# EasyEDA Pro project 交直流电流检测.eprj

# Schematic Schematic1
Board Name: Board1; Create Date: 2025-11-02; Page Name: P1; Project Name: 交直流电流检测; Schematic Name: Schematic1; Update Date: 2026-01-12; Company: 嘉立创EDA; Page Size: A4; Version: V1.0
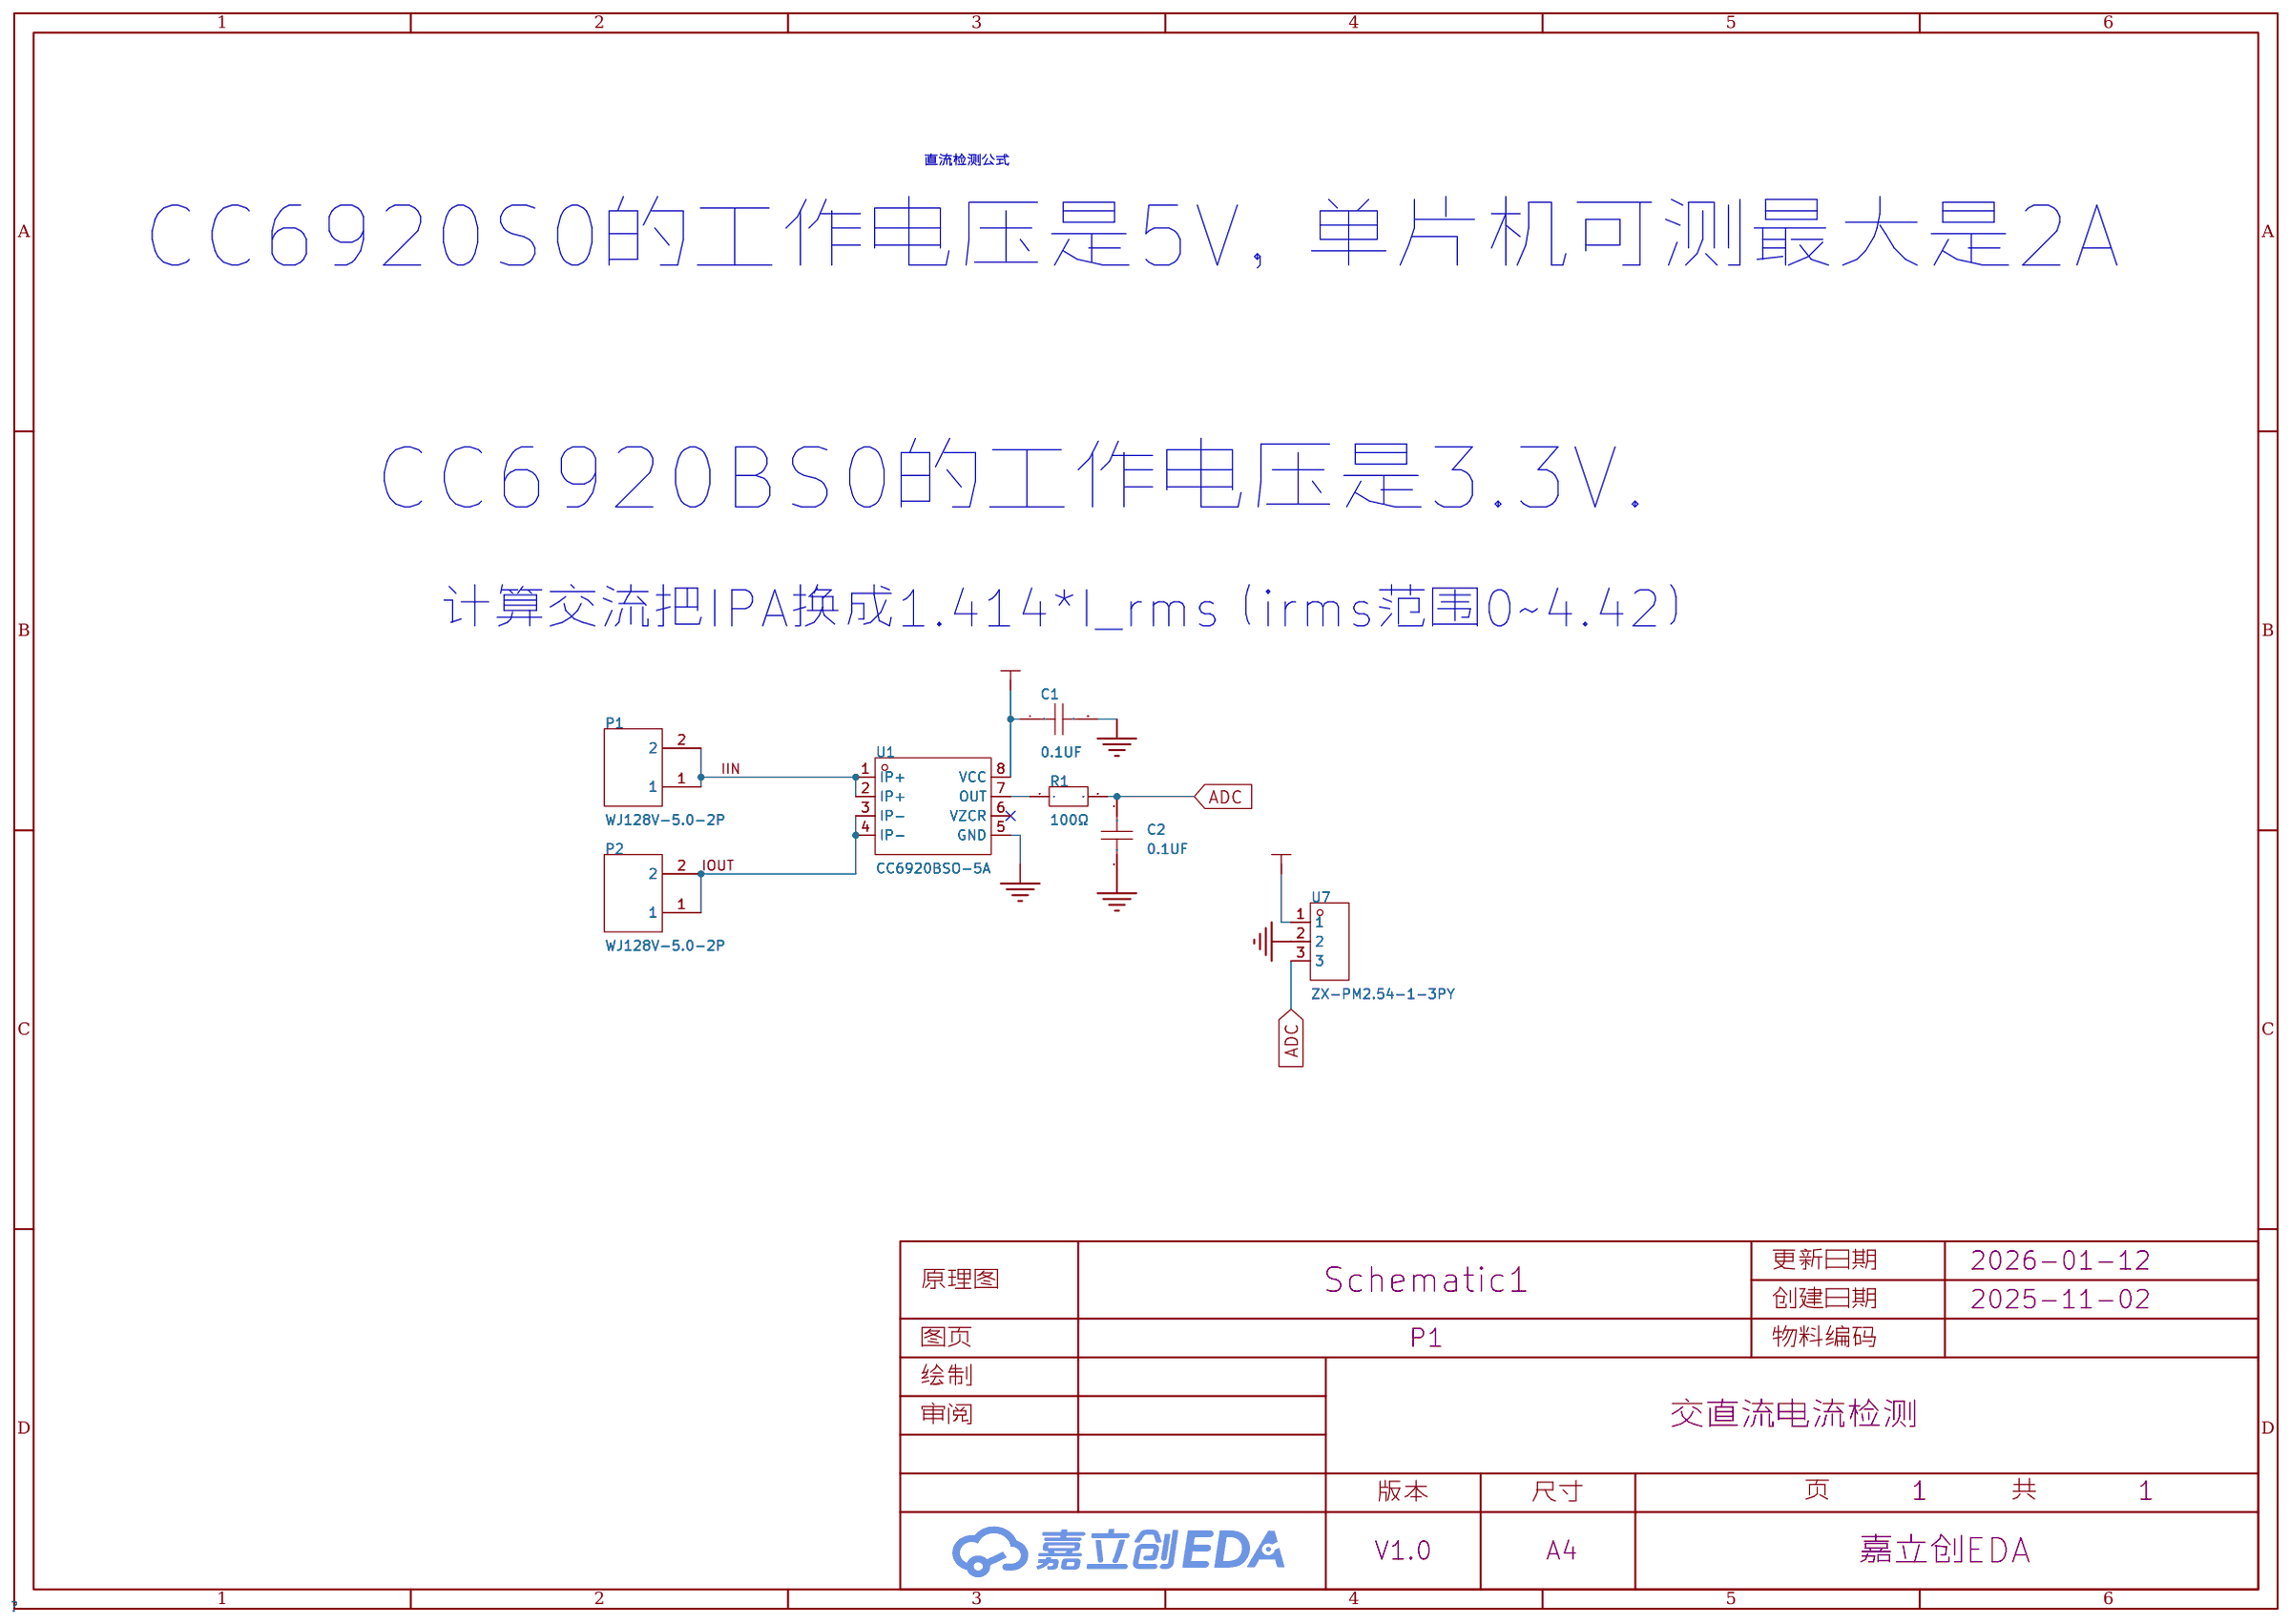
[diagram p0: schematic sheet]

## Parts
C1  0.1UF  [C0805]
C2  0.1UF  [C0805]
P1  WJ128V-5.0-2P  [CONN-TH_2P-P5.00_WJ128V-5.0-2P]
P2  WJ128V-5.0-2P  [CONN-TH_2P-P5.00_WJ128V-5.0-2P]
R1  100Ω  [C0805]
U1  CC6920BSO-5A  [SOP-8_L4.9-W3.9-P1.27-LS6.0-BL]
U7  ZX-PM2.54-1-3PY  [HDR-TH_3P-P2.54-V-F]

## Library data of the parts
C1 C2 = C2012C0G2A103JT000N: LCSC Part Name: 10nF ±5% 100V; Supplier Part: C49296936; Manufacturer: TDK; Supplier Footprint: 0805; JLCPCB Part Class: 扩展库; Datasheet: https://item.szlcsc.com/datasheet/C2012C0G2A103JT000N/51750894.html; Supplier: LCSC; Tolerance: ±5%; Voltage Rating: 100V
P1 P2 = WJ128V-5.0-2P: LCSC Part Name: 5mm 1x2P 排数:1 每排P数:2 直插; Supplier Part: C8269; Manufacturer: KANGNEX(康奈克斯电气); Supplier Footprint: 插件,P=5mm; JLCPCB Part Class: 扩展库; Datasheet: https://atta.szlcsc.com/upload/public/pdf/source/20191225/C8269_1FF44D6D2E83DB14A7CA266A410FD9AD.pdf; Supplier: LCSC; Structure: 1x2P; Pitch: 5mm; Color: 绿色; Mounting Style: 直插; Current Rating (Max): 20A; Voltage Rating (Max): 250V; Number of Pins: 2P; Number of Rows: 1; Wire Gauge - AWG: 12~22; Wire Gauge - mm2: 2.5; Number of PINs Per Row: 2; Operating Temperature Range: -40℃~+105℃
R1 = ERJ-U06F2R20V: LCSC Part Name: 2.2Ω ±1% 125mW 厚膜电阻; Supplier Part: C3948024; Manufacturer: PANASONIC(松下); Supplier Footprint: 0805; JLCPCB Part Class: 扩展库; Datasheet: https://atta.szlcsc.com/upload/public/pdf/source/20240408/99A45AC14EAA6AC337D556AA79AC87B5.pdf; Supplier: LCSC; Type: 厚膜电阻; Tolerance: ±1%; Power(Watts): 125mW; Temperature Coefficient: -100ppm/℃~+600ppm/℃; Operating Temperature: -55℃~+155℃
U1 = CC6920BSO-5A: Supplier Part: C2880430; Manufacturer: CrossChip(成都芯进); Supplier Footprint: SOP-8; JLCPCB Part Class: 扩展库; Datasheet: https://atta.szlcsc.com/upload/public/pdf/source/20241128/C0E6ECA7AE7321445B7BA60B45AD2C20.pdf; Supplier: LCSC; Current Range: -5A~5A; Supply Voltage: 3.3V; Isolated Voltage Withstand: 3500Vrms; Sensitivity: 264mV/A; Standby Current: 20mA; Operating Temperature: -40℃~+125℃
U7 = ZX-PM2.54-1-3PY: LCSC Part Name: 1x3P 间距:2.54mm 直插; Supplier Part: C7499323; Manufacturer: Megastar(兆星); Supplier Footprint: 插件,P=2.54mm; Datasheet: https://item.szlcsc.com/datasheet/ZX-PM2.54-1-3PY/8573984.html; Supplier: LCSC; Holes Structure: 1x3P; Pitch: 2.54mm; Circular Hole / Square Hole: 方孔; Mounting Type: 直插; Number of Rows: 单排; Number of Positions: 3P; Current Rating: 3A; Holes Direction: 顶部; Insulation Height: 8.5mm; Contact Plating: 金; Operating Temperature: -40℃~+105℃; PIN Length: 3.2mm

## Nets
+3.3V: C1.1 U1.8(VCC) U7.1
GND: C1.2 C2.1 U1.5(GND) U7.2
ADC: C2.2 R1.2 U7.3
IIN: P1.1 P1.2 U1.1(IP+) U1.2(IP+)
IOUT: P2.1 P2.2 U1.3(IP-) U1.4(IP-)
$1N379: R1.1 U1.7(OUT)

Not connected (* = marked no-connect by the designer): U1 6(VZCR)*

## Notes on the sheet
- 直流检测公式
- CC6920S0的工作电压是5V，单片机可测最大是2A
- CC6920BS0的工作电压是3.3V.
- 计算交流把IPA换成1.414*I_rms（irms范围0~4.42）

# Board PCB1
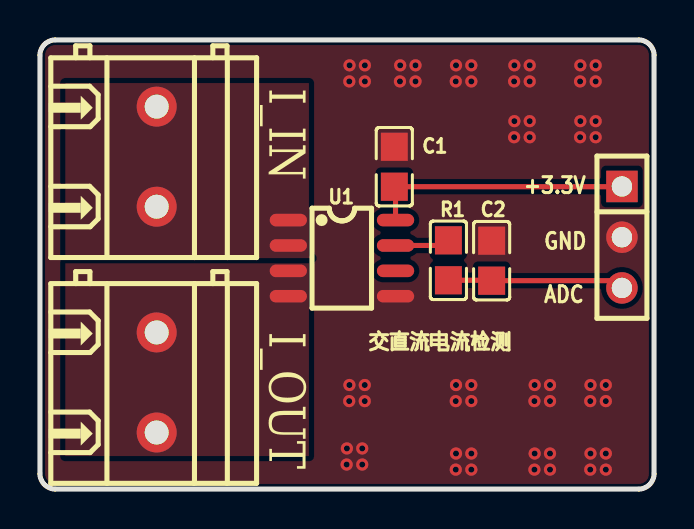
[diagram p1: board, top side]
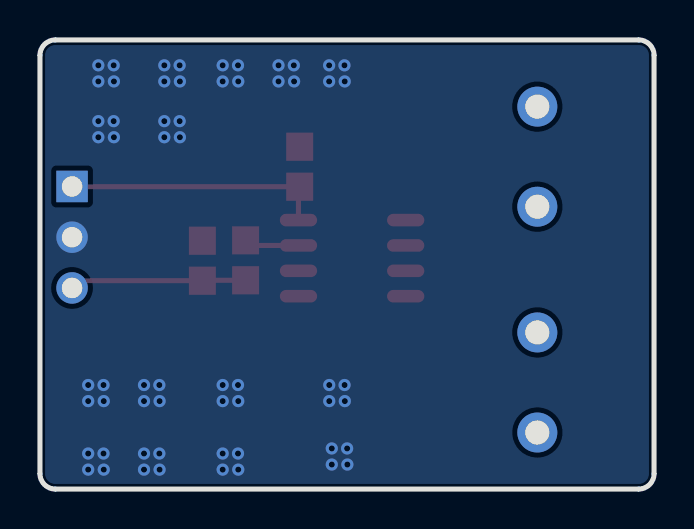
[diagram p2: board, bottom side, seen from below]

Outline 30.73 x 22.48 mm; copper layers: Top Layer, Bottom Layer. Coordinates in mm from the lower left corner of the outline.
Outline path: 0,21.72 0,0.76 arc(0.22,0.22) 0.76,0 29.97,0 arc(30.51,0.22) 30.73,0.76 30.73,21.72 arc(30.51,22.26) 29.97,22.48 0.76,22.48 arc(0.22,22.26) 0,21.72
Stack: Top Layer 0.035mm / Dielectric1 1.51mm FR4 er 4.5 / Bottom Layer 0.035mm

## Design rules (mm)
template: 自定义配置
spacing copperThickness1oz (default): track to track 0.102, other pairs 0.152 to 0.3
spacing copperThickness2oz: track to track 0.203, other pairs 0.152 to 0.3
track width copperThickness1oz (default): min 0.127, default 0.254, max 2.54
track width copperThickness2oz: min 0.203, default 0.254, max 2.54
differential pair differentialPair (default): width min 0.127, default 0.254, max 2.54; gap min 0.152, default 0.152
via viaSize (default): diameter min 0.5, default 0.61, max 10; hole min 0.3, default 0.305, max 6.3

## Placement (name value [footprint] x y rotation side)
C1  0.1UF  [C0805]  17.74 16.13 90 top
C2  0.1UF  [C0805]  22.61 11.43 270 top
P1  WJ128V-5.0-2P  [CONN-TH_2P-P5.00_WJ128V-5.0-2P]  5.84 16.64 270 top
P2  WJ128V-5.0-2P  [CONN-TH_2P-P5.00_WJ128V-5.0-2P]  5.84 5.33 270 top
R1  100Ω  [C0805]  20.44 11.45 270 top
U1  CC6920BSO-5A  [SOP-8_L4.9-W3.9-P1.27-LS6.0-BL]  15.11 11.56 270 top
U7  ZX-PM2.54-1-3PY  [HDR-TH_3P-P2.54-V-F]  29.13 12.61 270 top

## Footprints (pads in the part's own frame, mm; a bottom-side part is the same pattern mirrored in y, then rotated)
C0805
  rect 1.41x1.35 smd: 1(-1,0) 2(1,0)
CONN-TH_2P-P5.00_WJ128V-5.0-2P
  round 2 hole 1.2: 1(-2.505,0) 2(2.505,0)
HDR-TH_3P-P2.54-V-F
  rect 1.575x1.575 hole 1.02: 1(-2.54,0)
  round 1.575 hole 1.02: 2(0,0) 3(2.54,0)
SOP-8_L4.9-W3.9-P1.27-LS6.0-BL
  oval 0.63x1.865 smd: 1(-1.905,-2.683) 2(-0.635,-2.683) 3(0.635,-2.683) 4(1.905,-2.683) 5(1.905,2.683) 6(0.635,2.683) 7(-0.635,2.683) 8(-1.905,2.683)

## Nets
As in the schematic.

Pads without a net: U1 6

## Via types
v1: diameter 0.61, hole 0.305, Top Layer to Bottom Layer, 60 vias

## Routing (per net, layer and track width the routed paths; a pad name or vN(x,y) marks a point on that pad's centre or on a via; arc(x,y) is an arc through that point)
+3.3V: length 13.1
  Top Layer w0.254: U7.1 29.12,15.13 C1.1 17.8,15.07 U1.8
GND:
  vias: v1(15.36,2.03) v1(15.35,1.23) v1(15.49,21.21) v1(15.48,20.4) v1(15.49,5.21) v1(15.48,4.4) v1(16.13,2.03) v1(16.13,1.23) v1(16.26,21.21) v1(16.26,20.4) v1(16.26,5.21) v1(16.26,4.4) v1(18.02,20.4) v1(18.03,21.21) v1(18.8,21.21) v1(18.8,20.4) v1(20.81,20.4) v1(20.81,4.4) v1(20.81,0.97) v1(20.82,21.21) v1(20.82,5.21) v1(20.82,1.78) v1(21.59,21.21) v1(21.59,20.4) v1(21.59,5.21) v1(21.59,4.4) v1(21.59,1.78) v1(21.59,0.97) v1(23.74,21.21) v1(23.73,20.4) v1(23.74,18.42) v1(23.73,17.61) v1(24.51,21.21) v1(24.51,20.4) v1(24.51,18.42) v1(24.51,17.61) v1(24.76,5.21) v1(24.75,4.4) v1(24.76,1.78) v1(24.75,0.97) v1(25.53,5.21) v1(25.53,4.4) v1(25.53,1.78) v1(25.53,0.97) v1(27.05,21.21) v1(27.03,20.4) v1(27.05,18.42) v1(27.03,17.61) v1(27.55,5.21) v1(27.54,4.4) v1(27.55,1.78) v1(27.54,0.97) v1(27.81,21.21) v1(27.81,20.4) v1(27.81,18.42) v1(27.81,17.61) v1(28.32,5.21) v1(28.32,4.4) v1(28.32,1.78) v1(28.32,0.97)
ADC: length 8.8
  Top Layer w0.254: U7.3 28.76,10.43 C2.2 22.59,10.45 R1.2
$1N379: length 2.8
  Top Layer w0.254: U1.7 20.19,12.19 R1.1

## Copper pours and planes (outline as drawn; the poured copper is in the pictures)
GND on Top Layer: 4.44,-6.6 36.19,-6.6 36.19,-23.37 4.44,-23.37
GND on Top Layer: -9.53,27.31 45.21,27.31 45.21,-12.45 -9.53,-12.45
GND on Bottom Layer: -12.19,28.7 51.94,28.7 51.94,-13.97 -12.19,-13.97
IIN on Top Layer: 1.27,20.32 13.59,20.32 13.59,11.56 1.27,11.56
IOUT on Top Layer: 1.27,11.3 13.46,11.3 13.46,1.65 1.27,1.65

## Text on the board
Top Silkscreen Layer: +3.3V | GND | ADC | 交直流电流检测 | I_IN | I_OUT
